# EasyEDA Pro project Armor_ProProject.epro, schematic Schematic6
Create Date: 2023-03-10; Page Name: P1; Project Name: LED; Schematic Name: Schematic6; Update Date: 2023-03-10; Company: 嘉立创EDA; Page Size: A4; Version: V1.0
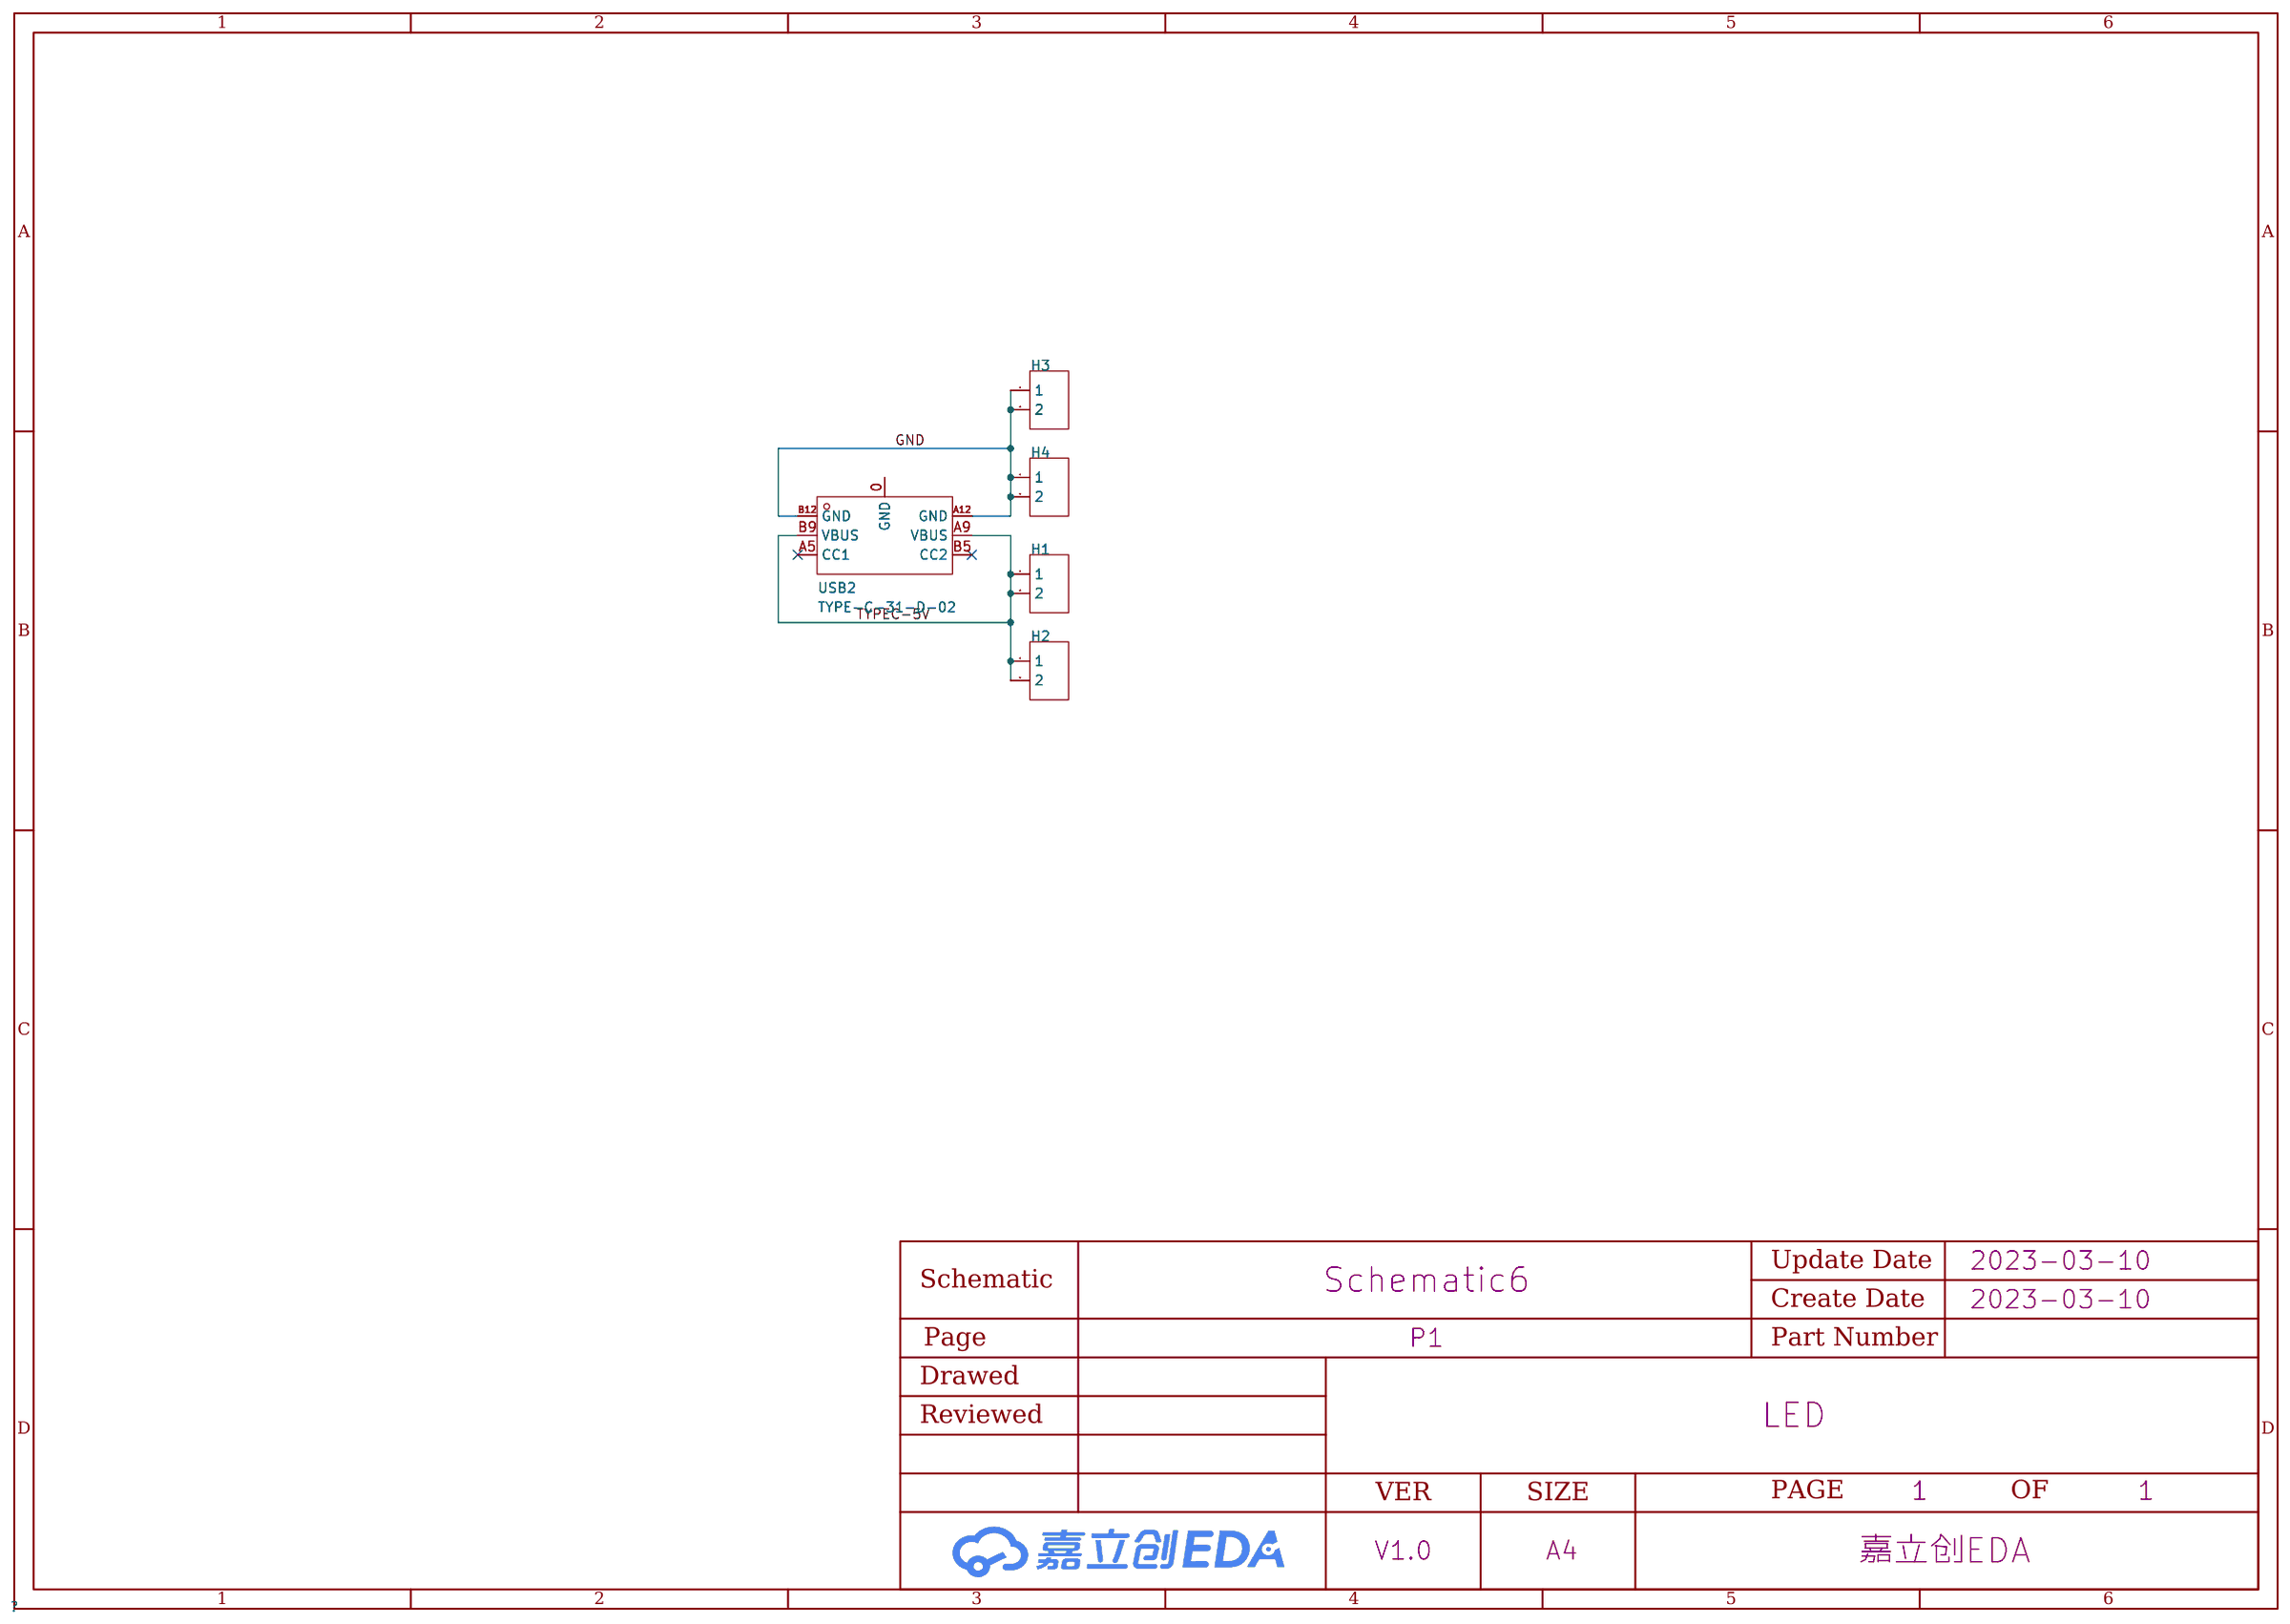
[diagram p1: schematic sheet]

## Parts
H1  -  [HDR-TH_2P-P2.54-V-F]
H2  -  [HDR-TH_2P-P2.54-V-F]
H3  -  [HDR-TH_2P-P2.54-V-F]
H4  -  [HDR-TH_2P-P2.54-V-F]
USB2  TYPE-C-31-D-02  [USB-C-SMD_TYPE-C-31-D-02]

## Library data of the parts
H1-H4 = HDR-F_2.54_1x2P: Supplier Part: C49661; Supplier Footprint: 插件
USB2 = TYPE-C-31-D-02: LCSC Part Name: 立式TYPE-C; Supplier Part: C707317; Manufacturer: 韩国韩荣; JLCPCB Part Class: Extended Part; Datasheet: https://atta.szlcsc.com/upload/public/pdf/source/20200721/C707317_DD92A8411CE7F6B9DE873484D469419F.pdf; Supplier: LCSC

## Nets
GND: H3.1 H3.2 H4.1 H4.2 USB2.A12(GND) USB2.B12(GND)
TYPEC-5V: H1.1 H1.2 H2.1 H2.2 USB2.A9(VBUS) USB2.B9(VBUS)

Not connected (* = marked no-connect by the designer): USB2 0(GND) A5(CC1)* B5(CC2)*
